# EasyEDA schematic LcsNodes-Extension-Combo-1-Board-B.02.00.json

## Sheets
1 Connector-and-Logic: TITLE: LcsNode-Extension-Occ-Detect\nConnector, Board Select Logic, etc.; REV: B.02.00; Date: 2023-11-07; Sheet: 2/4; Drawn By: helmut-f; Company: Your Company
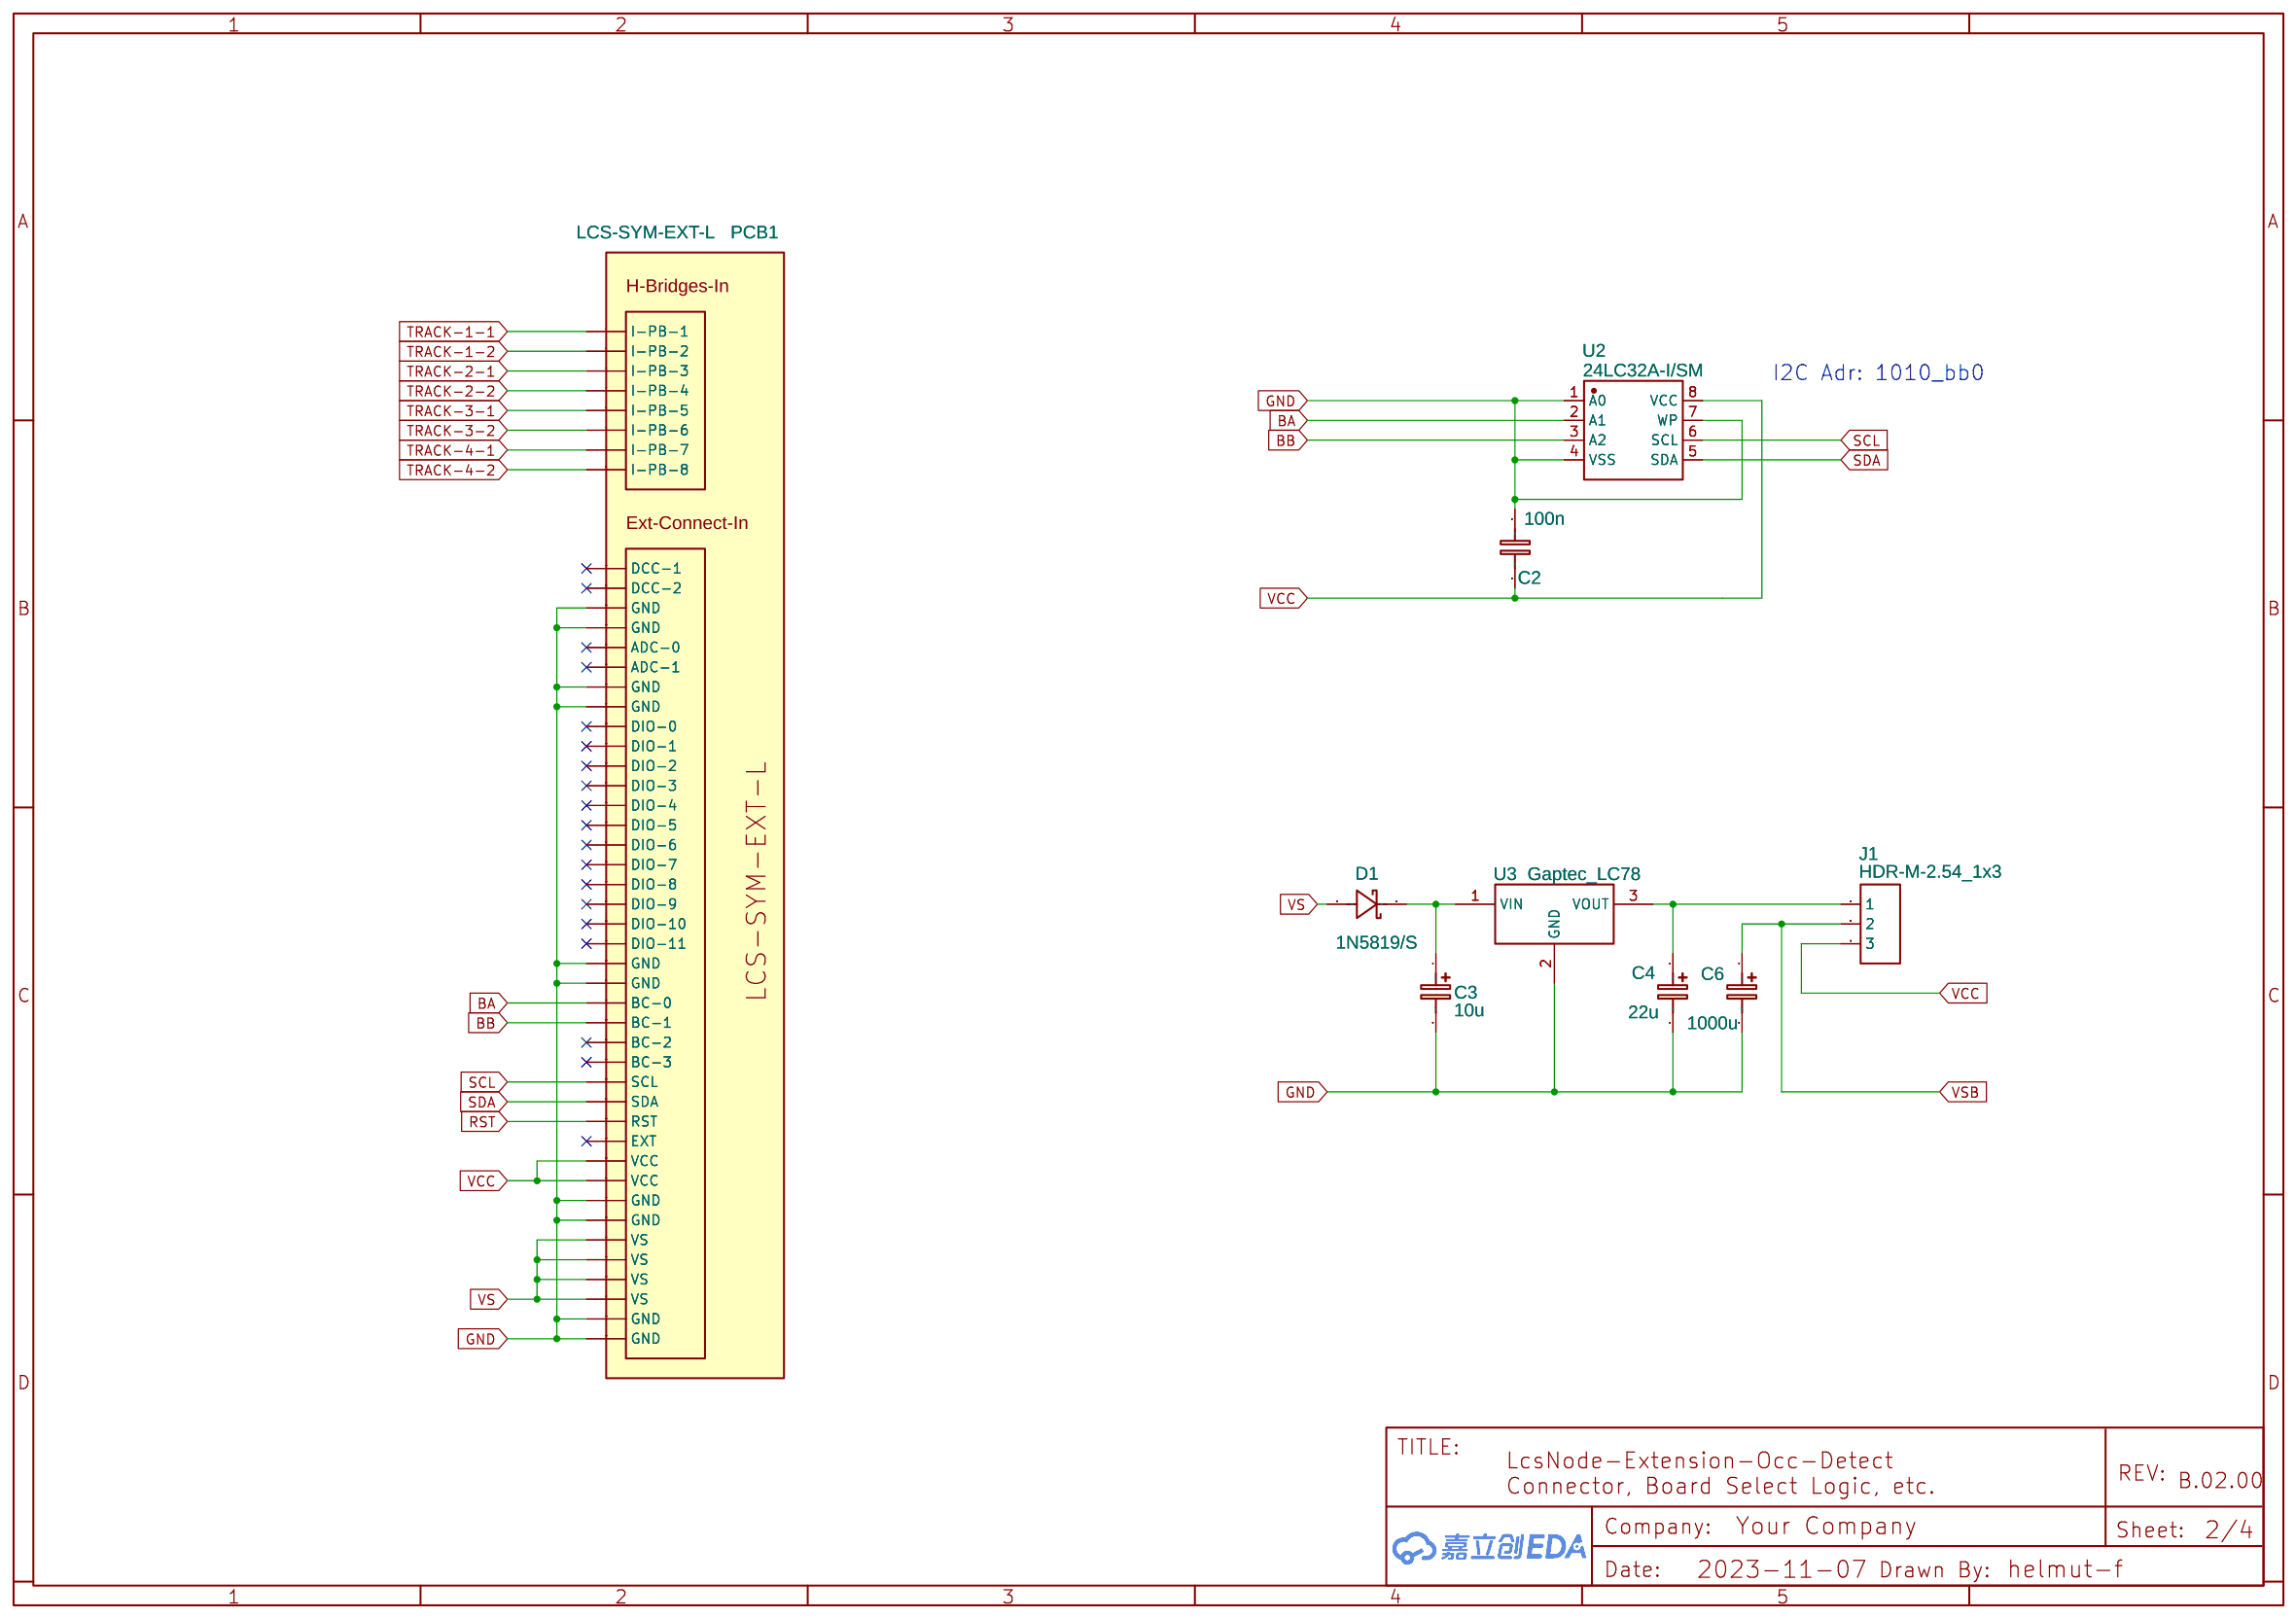
[diagram p0: Connector-and-Logic]
2 Sensor-Array: TITLE: LcsNode-Extension-Combo-1\nSensor Array; Date: 19-01-2025; Sheet: 3/4
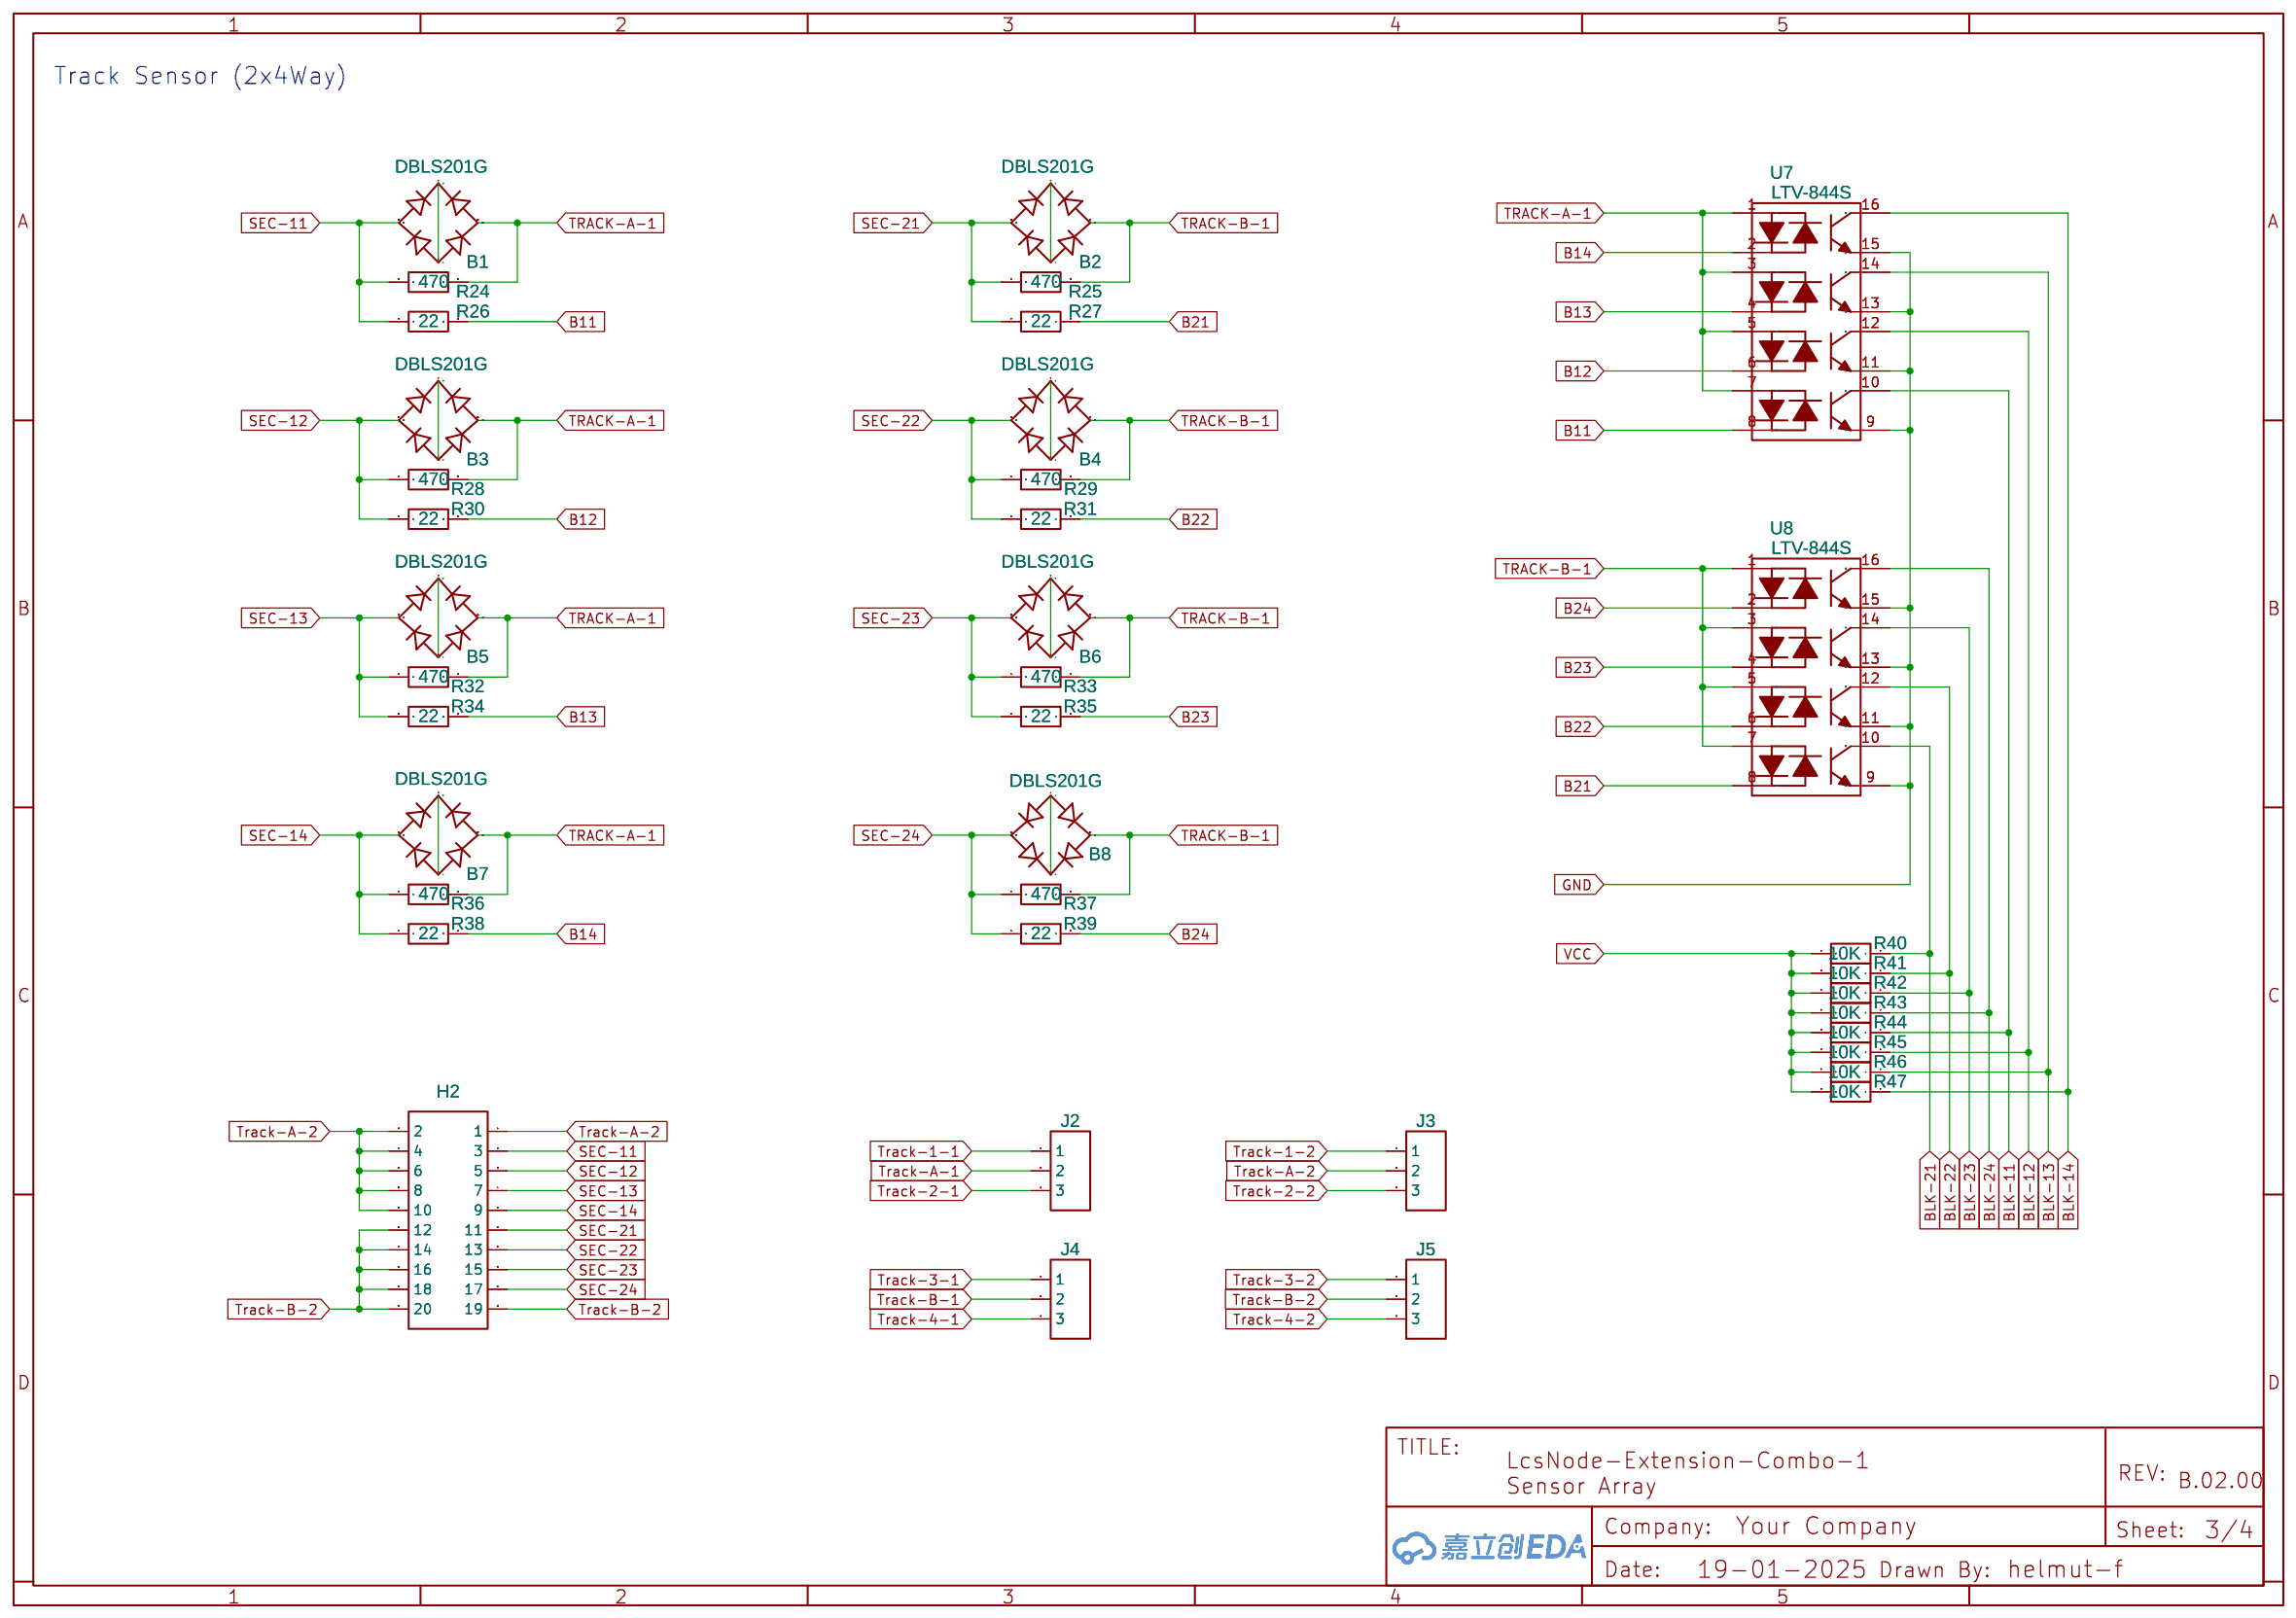
[diagram p1: Sensor-Array]
3 High Level Schematic: TITLE: LcsNode-Extension-Combo-1\nHigh Level Diagram; Date: 19-01-2025; Sheet: 1/4
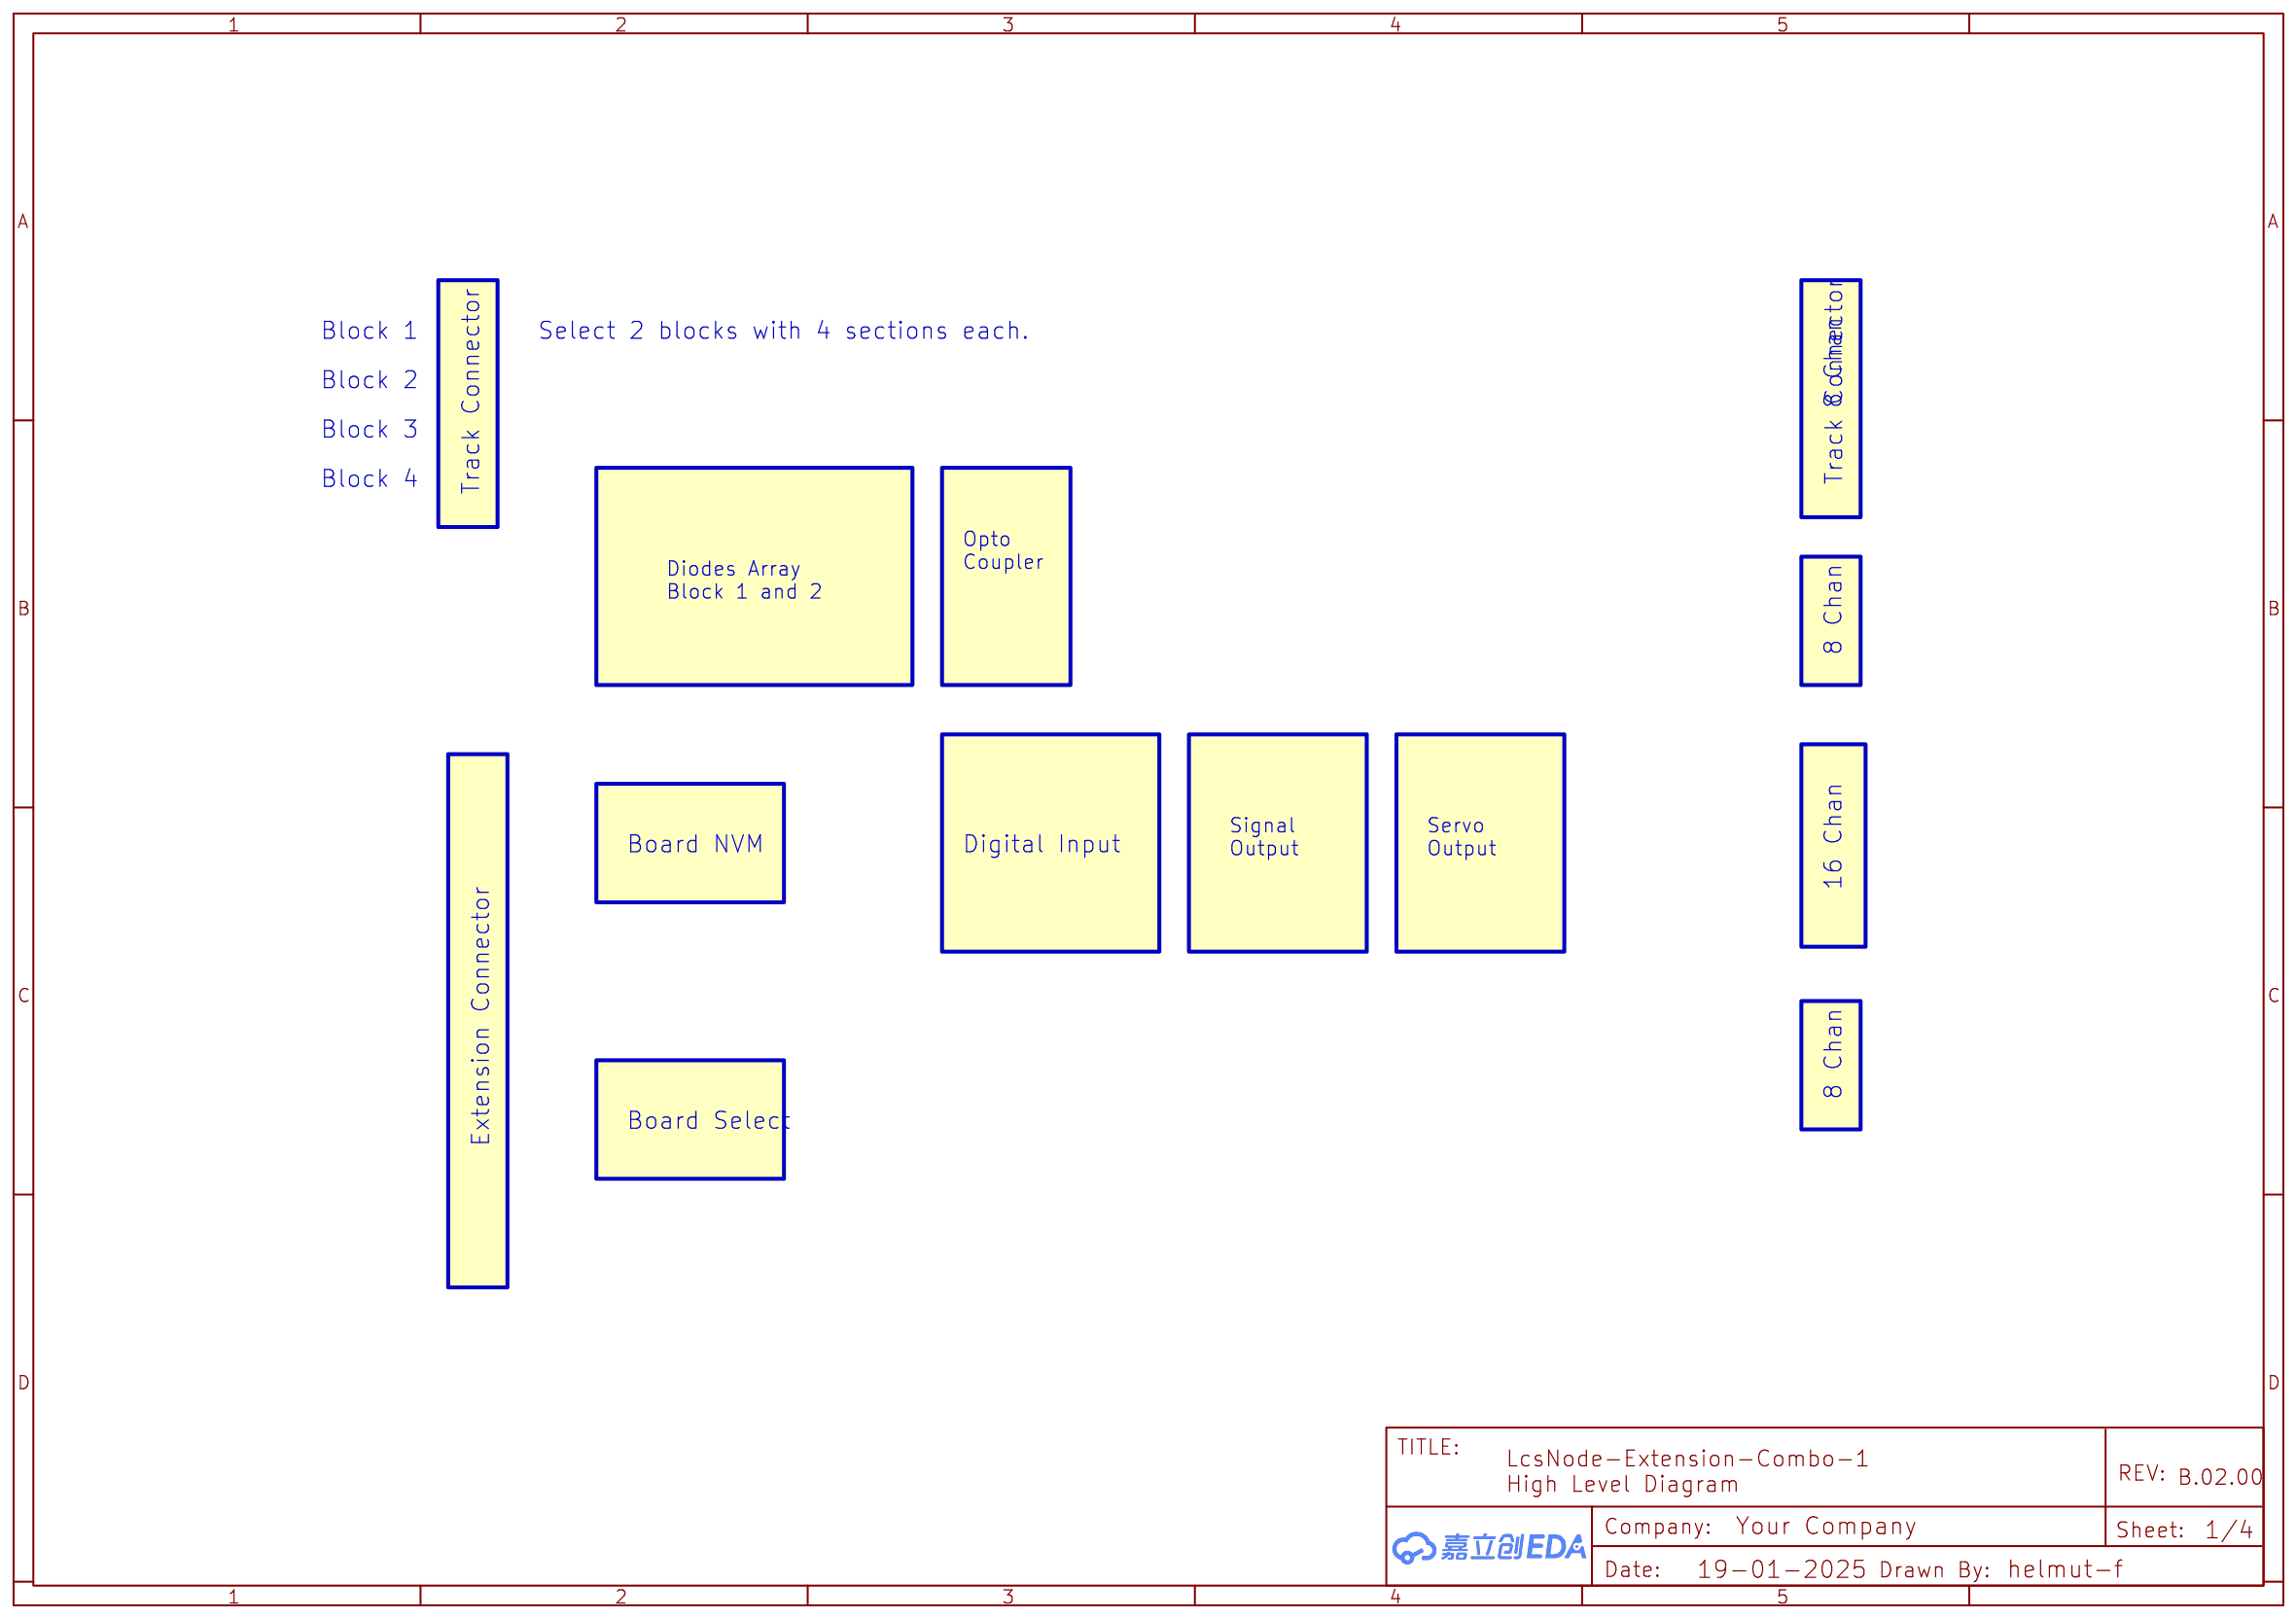
[diagram p2: High Level Schematic]
4 GPIO, Servo, Signal: TITLE: Sheet_1; REV: 1.0; Date: 2025-01-19; Sheet: 1/1
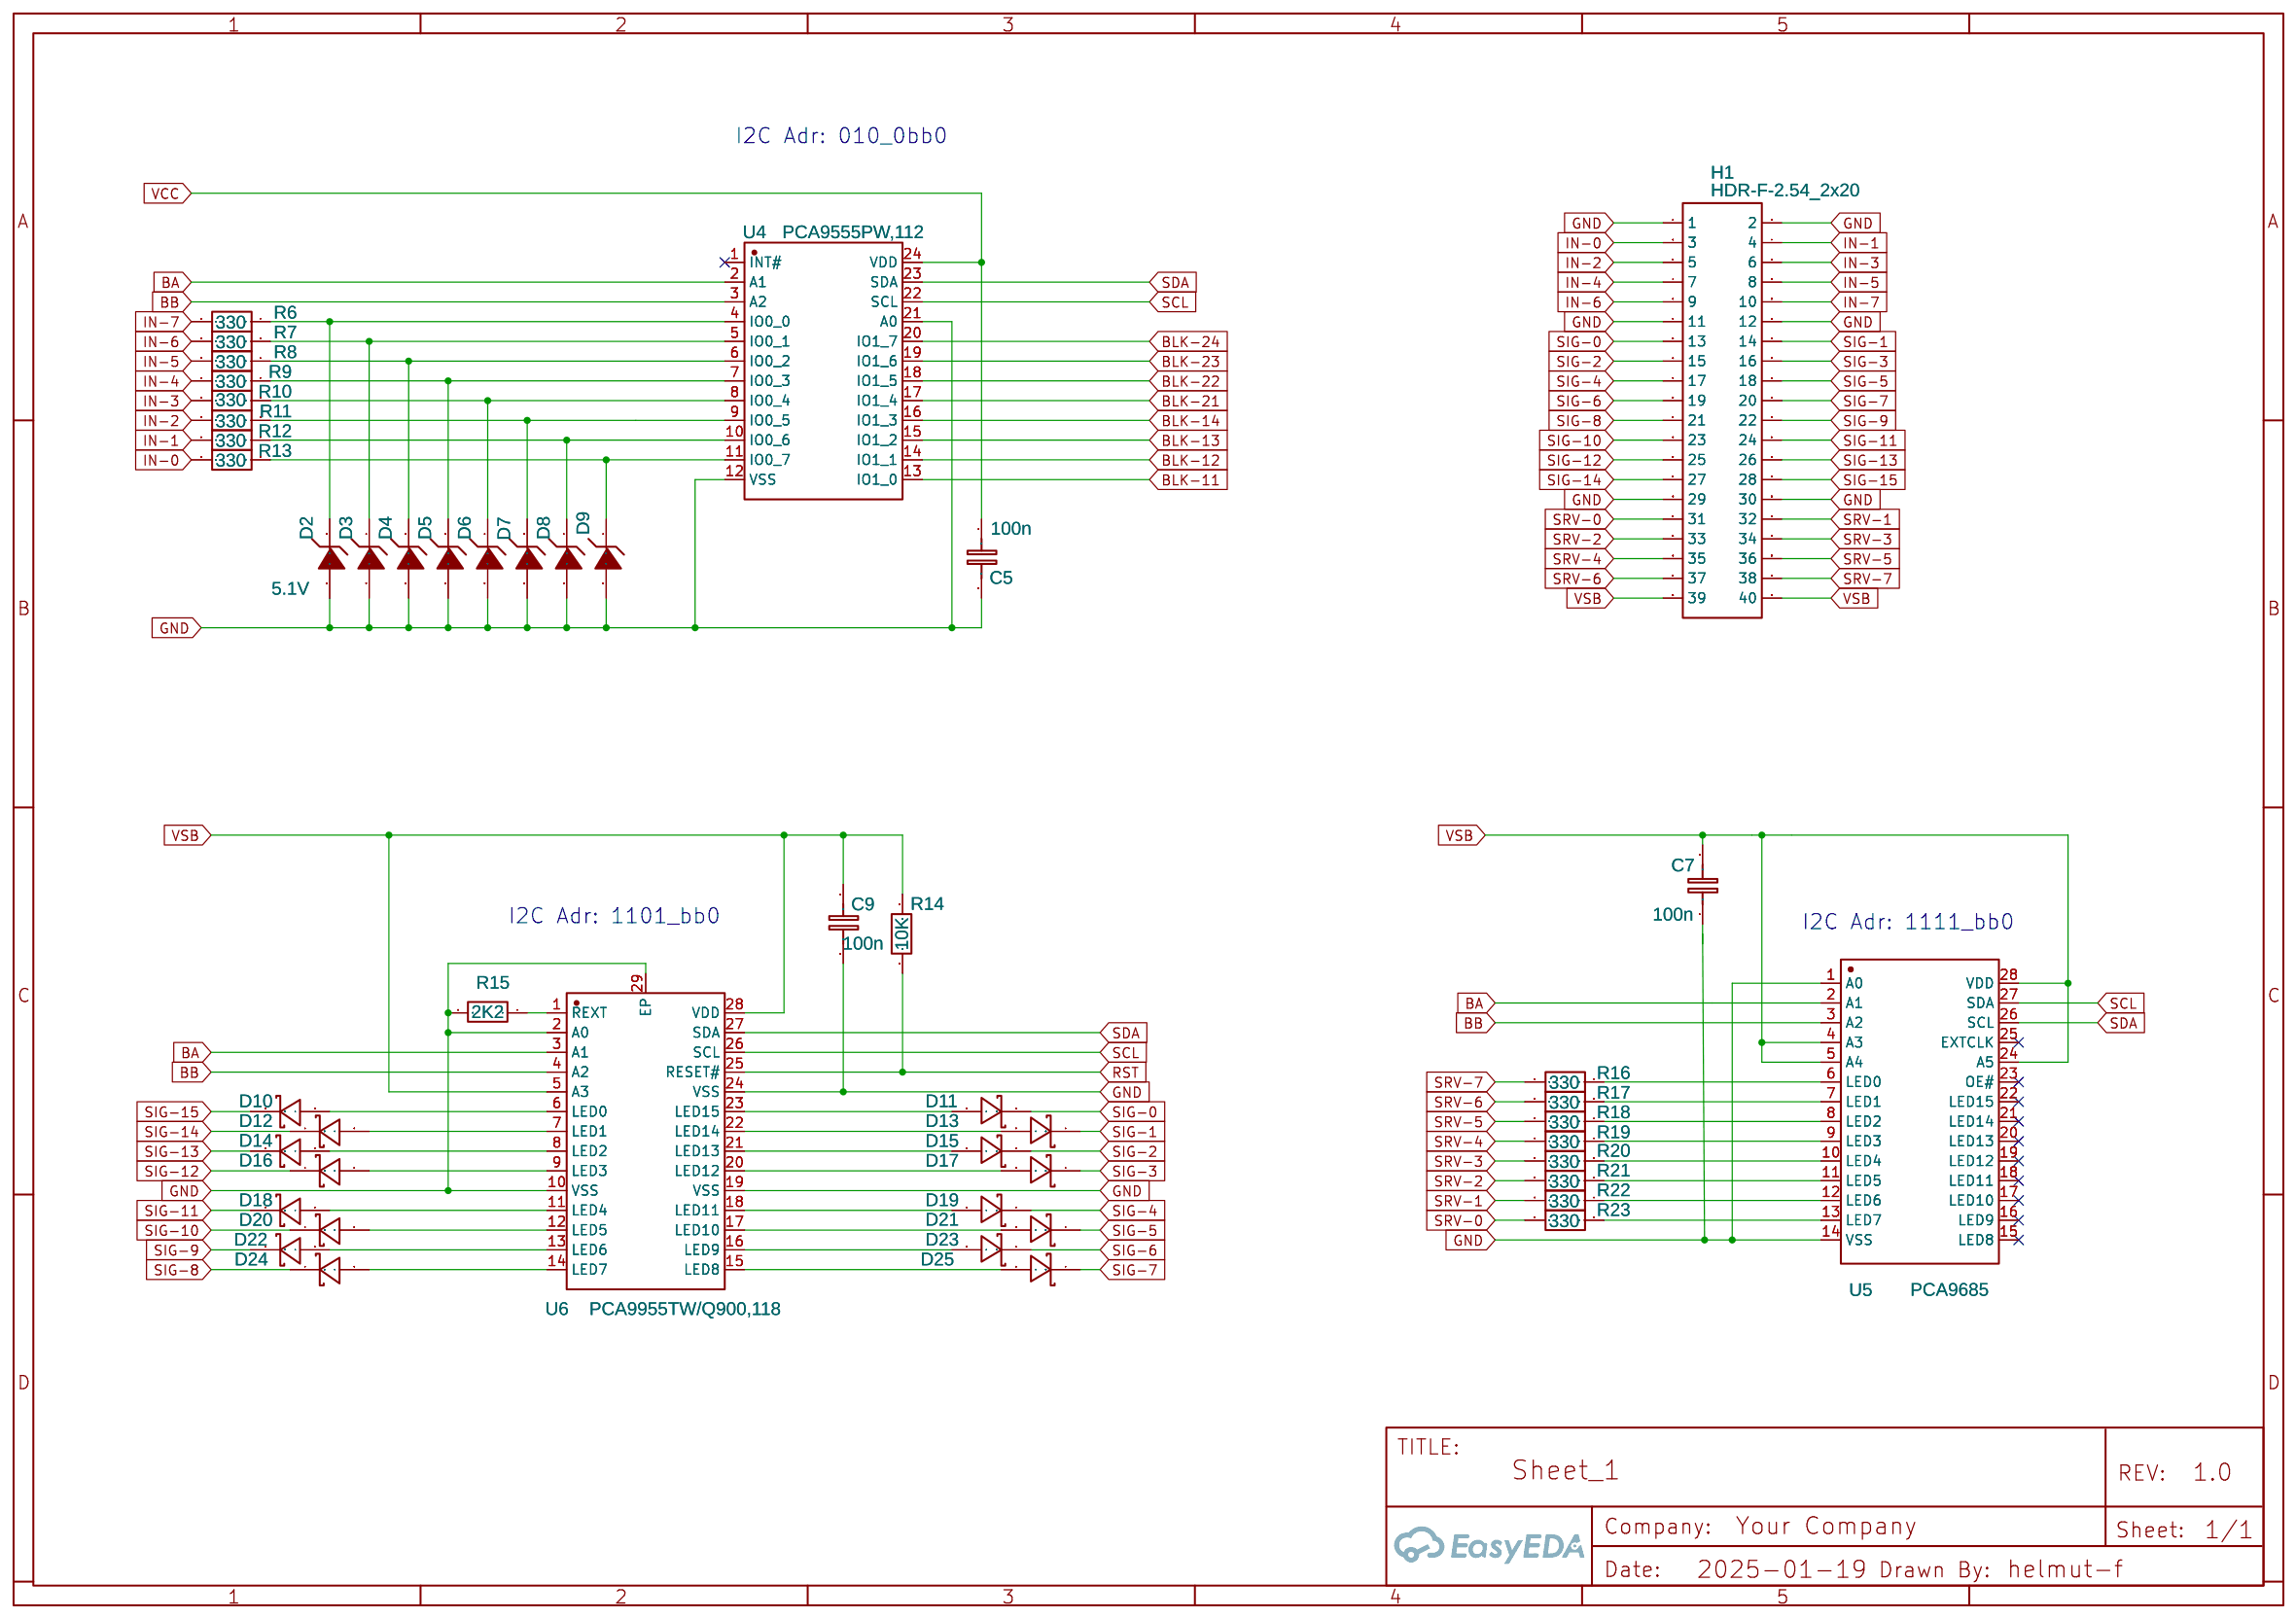
[diagram p3: GPIO, Servo, Signal]

## Parts
sheet Connector-and-Logic
C2  100n  [C1206]
C3  10u  [CAP-D5.0×H5.5]
C4  22u  [CAP-D5.0×H5.5]
C6  1000u  [CAP-SMD_BD10.0-L10.3-W10.3-FD-LS11.0]
D1  1N5819/S  [SMA_L4.3-W2.6-LS5.2-R-RD]
J1  HDR-M-2.54_1x3  [HDR-M-2.54_1X3]
PCB1  LCS-SYM-EXT-L  [LCS-FP-EXT-L-10X12]
U2  24LC32A-I/SM  [SOIC-8_L4.9-W3.9-P1.27-LS6.0-BL]
U3  Gaptec_LC78  [GAPTEC_LC78]
sheet GPIO, Servo, Signal
C5  100n  [C1206]
C7  100n  [C1206]
C9  100n  [C1206]
D2  5.1V  [SOD-80C_L3.3-W1.5-RD]
D3  5.1V  [SOD-80C_L3.3-W1.5-RD]
D4  5.1V  [SOD-80C_L3.3-W1.5-RD]
D5  5.1V  [SOD-80C_L3.3-W1.5-RD]
D6  5.1V  [SOD-80C_L3.3-W1.5-RD]
D7  5.1V  [SOD-80C_L3.3-W1.5-RD]
D8  5.1V  [SOD-80C_L3.3-W1.5-RD]
D9  5.1V  [SOD-80C_L3.3-W1.5-RD]
D10  BAS85  [LL-34_L3.5-W1.5-RD]
D11  BAS85  [LL-34_L3.5-W1.5-RD]
D12  BAS85  [LL-34_L3.5-W1.5-RD]
D13  BAS85  [LL-34_L3.5-W1.5-RD]
D14  BAS85  [LL-34_L3.5-W1.5-RD]
D15  BAS85  [LL-34_L3.5-W1.5-RD]
D16  BAS85  [LL-34_L3.5-W1.5-RD]
D17  BAS85  [LL-34_L3.5-W1.5-RD]
D18  BAS85  [LL-34_L3.5-W1.5-RD]
D19  BAS85  [LL-34_L3.5-W1.5-RD]
D20  BAS85  [LL-34_L3.5-W1.5-RD]
D21  BAS85  [LL-34_L3.5-W1.5-RD]
D22  BAS85  [LL-34_L3.5-W1.5-RD]
D23  BAS85  [LL-34_L3.5-W1.5-RD]
D24  BAS85  [LL-34_L3.5-W1.5-RD]
D25  BAS85  [LL-34_L3.5-W1.5-RD]
H1  HDR-F-2.54_2x20  [HDR-F-2.54_2X20]
R6  330  [R1206]
R7  330  [R1206]
R8  330  [R1206]
R9  330  [R1206]
R10  330  [R1206]
R11  330  [R1206]
R12  330  [R1206]
R13  330  [R1206]
R14  10K  [R1206]
R15  2K2  [R1206]
R16  330  [R1206]
R17  330  [R1206]
R18  330  [R1206]
R19  330  [R1206]
R20  330  [R1206]
R21  330  [R1206]
R22  330  [R1206]
R23  330  [R1206]
U4  PCA9555PW,112  [TSSOP-24_L7.8-W4.4-P0.65-LS6.4-BL]
U5  PCA9685  [TSSOP-28_L9.7-W4.4-P0.65-LS6.4-BL]
U6  PCA9955TW/Q900,118  [HTSSOP-28_L9.8-W4.5-P0.65-LS6.6-BL-EP]
sheet Sensor-Array
B1  DBLS201G  [DBS]
B2  DBLS201G  [DBS]
B3  DBLS201G  [DBS]
B4  DBLS201G  [DBS]
B5  DBLS201G  [DBS]
B6  DBLS201G  [DBS]
B7  DBLS201G  [DBS]
B8  DBLS201G  [DBS]
H2  HDR-F-2.54_2x10  [HDR-F-2.54_2X10]
J2  HDR-M-2.54_1x3  [HDR-M-2.54_1X3]
J3  HDR-M-2.54_1x3  [HDR-M-2.54_1X3]
J4  HDR-M-2.54_1x3  [HDR-M-2.54_1X3]
J5  HDR-M-2.54_1x3  [HDR-M-2.54_1X3]
R24  470  [R1206]
R25  470  [R1206]
R26  22  [R1206]
R27  22  [R1206]
R28  470  [R1206]
R29  470  [R1206]
R30  22  [R1206]
R31  22  [R1206]
R32  470  [R1206]
R33  470  [R1206]
R34  22  [R1206]
R35  22  [R1206]
R36  470  [R1206]
R37  470  [R1206]
R38  22  [R1206]
R39  22  [R1206]
R40  10K  [R1206]
R41  10K  [R1206]
R42  10K  [R1206]
R43  10K  [R1206]
R44  10K  [R1206]
R45  10K  [R1206]
R46  10K  [R1206]
R47  10K  [R1206]
U7  LTV-844S  [OPTO-SMD-16_L19.8-W6.5-P2.54-LS10.2-BL]
U8  LTV-844S  [OPTO-SMD-16_L19.8-W6.5-P2.54-LS10.2-BL]

## Library data of the parts
C2 C5 C7 C9 = C_0603_EU: Contributor: LCEDA_Lib; Package Display: No
C3 C4 = CE_SMD_D5.0×H5.5_EU: Contributor: LCEDA_Lib
C6 = CE_TH_D4.0×F1.5_EU: Contributor: LCEDA_Lib
D1 = 1N5819/S: Supplier: LCSC; Supplier Part: C9900003833; JLCPCB Part Class: Extended Part; Contributor: LCSC
J1-J5 = HDR-M-2.54_1x3: Supplier Part: C180248; Supplier: LCSC; Contributor: LCEDA_Lib
PCB1 = LCS-SYM-EXT-L: Contributor: helmut-f; Package Display: No
U2 = 24LC32A-I/SM: Contributor: LCSC; Supplier: LCSC; Supplier Part: C616088; Manufacturer: MICROCHIP(美国微芯); JLCPCB Part Class: Extended Part
U3 = Gaptec_LC78: Contributor: SpicyMemeBoi; Package Display: No
D2-D9 = Diode Zener: Supplier: LCSC; Manufacturer: SEMTECH; Supplier Part: C14516; JLCPCB Part Class: Extended Part; Contributor: Arrost
D10-D25 = BAS85: Supplier: LCSC; Supplier Part: C475619; Manufacturer: SHIKUES(时科); Contributor: LCSC; JLCPCB Part Class: Extended Part
H1 = HDR-F-2.54_2x20: Supplier Part: C50982; Supplier: LCSC; Contributor: LCEDA_Lib
R6-R22 R24-R47 = R_AXIAL-0.3_EU: Contributor: LCEDA_Lib
R23 = R_AXIAL-0.3_EU: Contributor: LCEDA_Lib; Package Display: No
U4 = PCA9555PW,112: Supplier: LCSC; Supplier Part: C2688893; Manufacturer: NXP(恩智浦); Contributor: LCSC; JLCPCB Part Class: Extended Part
U5 = PCA9685PW/Q900,118: Supplier: LCSC; Manufacturer: NXP; Supplier Part: C92206; JLCPCB Part Class: Extended Part; Package Display: No
U6 = PCA9955TW/Q900,118: Supplier: LCSC; Supplier Part: C2678769; Manufacturer: NXP(恩智浦); Contributor: LCSC; JLCPCB Part Class: Extended Part
B1-B8 = DBLS201G: Single Phase 1.0 AMP Glass Passivated Bridge Rectifier
H2 = HDR-F-2.54_2x10: Supplier Part: C30867; Supplier: LCSC; Contributor: LCEDA_Lib
U7 U8 = LTV-844S: Supplier: LCSC; Supplier Part: C575506; Manufacturer: LITEON(台湾光宝); JLCPCB Part Class: Extended Part; Contributor: LCSC

## Nets
GND: C2.1 C3.2 C4.2 C5.2 C6.2 C7.1 C9.2 D2.2(A) D3.2(A) D4.2(A) D5.2(A) D6.2(A) D7.2(A) D8.2(A) D9.2(A) H1.1 H1.2 H1.11 H1.12 H1.29 H1.30 PCB1.12(GND) PCB1.13(GND) PCB1.16(GND) PCB1.17(GND) PCB1.30(GND) PCB1.31(GND) PCB1.42(GND) PCB1.43(GND) PCB1.48(GND) PCB1.49(GND) R15.2 U2.1(A0) U2.4(VSS) U2.7(WP) U3.2(GND) U4.12(VSS) U4.21(A0) U5.1(A0) U5.14(VSS) U6.2(A0) U6.10(VSS) U6.19(VSS) U6.24(VSS) U6.29(EP) U7.9 U7.11 U7.13 U7.15 U8.9 U8.11 U8.13 U8.15
VCC: C2.2 C5.1 J1.3 PCB1.40(VCC) PCB1.41(VCC) R40.2 R41.2 R42.2 R43.2 R44.2 R45.2 R46.2 R47.2 U2.8(VCC) U4.24(VDD)
B11: R26.2 U7.8
B12: R30.2 U7.6
B13: R34.2 U7.4
B14: R38.2 U7.2
B21: R27.2 U8.8
B22: R31.2 U8.6
B23: R35.2 U8.4
B24: R39.2 U8.2
BA: PCB1.32(BC-0) U2.2(A1) U4.2(A1) U5.2(A1) U6.3(A1)
BB: PCB1.33(BC-1) U2.3(A2) U4.3(A2) U5.3(A2) U6.4(A2)
BLK-11: R44.1 U4.13(IO1_0) U7.10
BLK-12: R45.1 U4.14(IO1_1) U7.12
BLK-13: R46.1 U4.15(IO1_2) U7.14
BLK-14: R47.1 U4.16(IO1_3) U7.16
BLK-21: R40.1 U4.17(IO1_4) U8.10
BLK-22: R41.1 U4.18(IO1_5) U8.12
BLK-23: R42.1 U4.19(IO1_6) U8.14
BLK-24: R43.1 U4.20(IO1_7) U8.16
IN-0: H1.3 R13.2
IN-1: H1.4 R12.2
IN-2: H1.5 R11.2
IN-3: H1.6 R10.2
IN-4: H1.7 R9.2
IN-5: H1.8 R8.2
IN-6: H1.9 R7.2
IN-7: H1.10 R6.2
RST: PCB1.38(RST) R14.2 U6.25(RESET#)
SCL: PCB1.36(SCL) U2.6(SCL) U4.22(SCL) U5.27(SDA) U6.26(SCL)
SDA: PCB1.37(SDA) U2.5(SDA) U4.23(SDA) U5.26(SCL) U6.27(SDA)
SEC-11: B1.AC1 H2.3 R24.1 R26.1
SEC-12: B3.AC1 H2.5 R28.1 R30.1
SEC-13: B5.AC1 H2.7 R32.1 R34.1
SEC-14: B7.AC1 H2.9 R36.1 R38.1
SEC-21: B2.AC2 H2.11 R25.1 R27.1
SEC-22: B4.AC2 H2.13 R29.1 R31.1
SEC-23: B6.AC2 H2.15 R33.1 R35.1
SEC-24: B8.AC2 H2.17 R37.1 R39.1
SIG-0: D11.1(C) H1.13
SIG-1: D13.1(C) H1.14
SIG-2: D15.1(C) H1.15
SIG-3: D17.1(C) H1.16
SIG-4: D19.1(C) H1.17
SIG-5: D21.1(C) H1.18
SIG-6: D23.1(C) H1.19
SIG-7: D25.1(C) H1.20
SIG-8: D24.1(C) H1.21
SIG-9: D22.1(C) H1.22
SIG-10: D20.1(C) H1.23
SIG-11: D18.1(C) H1.24
SIG-12: D16.1(C) H1.25
SIG-13: D14.1(C) H1.26
SIG-14: D12.1(C) H1.27
SIG-15: D10.1(C) H1.28
SRV-0: H1.31 R23.2
SRV-1: H1.32 R22.2
SRV-2: H1.33 R21.2
SRV-3: H1.34 R20.2
SRV-4: H1.35 R19.2
SRV-5: H1.36 R18.2
SRV-6: H1.37 R17.2
SRV-7: H1.38 R16.2
TRACK-1-1: PCB1.1(I-PB-1)
Track-1-1: J2.1
TRACK-1-2: PCB1.2(I-PB-2)
Track-1-2: J3.1
TRACK-2-1: PCB1.3(I-PB-3)
Track-2-1: J2.3
TRACK-2-2: PCB1.4(I-PB-4)
Track-2-2: J3.3
TRACK-3-1: PCB1.5(I-PB-5)
Track-3-1: J4.1
TRACK-3-2: PCB1.6(I-PB-6)
Track-3-2: J5.1
TRACK-4-1: PCB1.7(I-PB-7)
Track-4-1: J4.3
TRACK-4-2: PCB1.8(I-PB-8)
Track-4-2: J5.3
TRACK-A-1: B1.AC2 B3.AC2 B5.AC2 B7.AC2 R24.2 R28.2 R32.2 R36.2 U7.1 U7.3 U7.5 U7.7
Track-A-1: J2.2
Track-A-2: H2.1 H2.2 H2.4 H2.6 H2.8 H2.10 J3.2
TRACK-B-1: B2.AC1 B4.AC1 B6.AC1 B8.AC1 R25.2 R29.2 R33.2 R37.2 U8.1 U8.3 U8.5 U8.7
Track-B-1: J4.2
Track-B-2: H2.12 H2.14 H2.16 H2.18 H2.19 H2.20 J5.2
VS: D1.1(A) PCB1.44(VS) PCB1.45(VS) PCB1.46(VS) PCB1.47(VS)
VSB: C6.1 C7.2 C9.1 H1.39 H1.40 J1.2 R14.1 U5.4(A3) U5.5(A4) U5.24(A5) U5.28(VDD) U6.5(A3) U6.28(VDD)
Net-(B1-+): B1.+ B1.-
Net-(B2-+): B2.+ B2.-
Net-(B3-+): B3.+ B3.-
Net-(B4-+): B4.+ B4.-
Net-(B5-+): B5.+ B5.-
Net-(B6-+): B6.+ B6.-
Net-(B7-+): B7.+ B7.-
Net-(B8-+): B8.+ B8.-
Net-(C3-1): C3.1 D1.2(K) U3.1(VIN)
Net-(C4-1): C4.1 J1.1 U3.3(VOUT)
Net-(D2-1): D2.1(C) R6.1 U4.4(IO0_0)
Net-(D3-1): D3.1(C) R7.1 U4.5(IO0_1)
Net-(D4-1): D4.1(C) R8.1 U4.6(IO0_2)
Net-(D5-1): D5.1(C) R9.1 U4.7(IO0_3)
Net-(D6-1): D6.1(C) R10.1 U4.8(IO0_4)
Net-(D7-1): D7.1(C) R11.1 U4.9(IO0_5)
Net-(D8-1): D8.1(C) R12.1 U4.10(IO0_6)
Net-(D9-1): D9.1(C) R13.1 U4.11(IO0_7)
Net-(D10-2): D10.2(A) U6.6(LED0)
Net-(D11-2): D11.2(A) U6.23(LED15)
Net-(D12-2): D12.2(A) U6.7(LED1)
Net-(D13-2): D13.2(A) U6.22(LED14)
Net-(D14-2): D14.2(A) U6.8(LED2)
Net-(D15-2): D15.2(A) U6.21(LED13)
Net-(D16-2): D16.2(A) U6.9(LED3)
Net-(D17-2): D17.2(A) U6.20(LED12)
Net-(D18-2): D18.2(A) U6.11(LED4)
Net-(D19-2): D19.2(A) U6.18(LED11)
Net-(D20-2): D20.2(A) U6.12(LED5)
Net-(D21-2): D21.2(A) U6.17(LED10)
Net-(D22-2): D22.2(A) U6.13(LED6)
Net-(D23-2): D23.2(A) U6.16(LED9)
Net-(D24-2): D24.2(A) U6.14(LED7)
Net-(D25-2): D25.2(A) U6.15(LED8)
Net-(R15-1): R15.1 U6.1(REXT)
Net-(R16-1): R16.1 U5.6(LED0)
Net-(R17-1): R17.1 U5.7(LED1)
Net-(R18-1): R18.1 U5.8(LED2)
Net-(R19-1): R19.1 U5.9(LED3)
Net-(R20-1): R20.1 U5.10(LED4)
Net-(R21-1): R21.1 U5.11(LED5)
Net-(R22-1): R22.1 U5.12(LED6)
Net-(R23-1): R23.1 U5.13(LED7)

Not connected (* = marked no-connect by the designer): PCB1 10(DCC-1)* 11(DCC-2)* 14(ADC-0)* 15(ADC-1)* 18(DIO-0)* 19(DIO-1)* 20(DIO-2)* 21(DIO-3)* 22(DIO-4)* 23(DIO-5)* 24(DIO-6)* 25(DIO-7)* 26(DIO-8)* 27(DIO-9)* 28(DIO-10)* 29(DIO-11)* 34(BC-2)* 35(BC-3)* 39(EXT)*; U4 1(INT#)*; U5 15(LED8)* 16(LED9)* 17(LED10)* 18(LED11)* 19(LED12)* 20(LED13)* 21(LED14)* 22(LED15)* 23(OE#)* 25(EXTCLK)*

## Notes on the sheets
sheet 1
- I2C Adr: 1010_bb0
sheet 2
- Track Sensor (2x4Way)
sheet 3
- Block 1
- Select 2 blocks with 4 sections each.
- Block 2
- Block 3
- 8 Chan
- Block 4
- Track Connector
- Track Connector
- Opto
  Coupler
- Diodes Array
  Block 1 and 2
- 8 Chan
- Board NVM
- Digital Input
- Signal
  Output
- Servo
  Output
- 16 Chan
- Board Select
- 8 Chan
- Extension Connector
sheet 4
- I2C Adr: 010_0bb0
- I2C Adr: 1101_bb0
- I2C Adr: 1111_bb0
